# Altium schematic sheet Rectifier.SchDoc: <Document>
size Letter; Engineer: <Engineer>; Organization: UPEL; Address1: USU Power Electronics Lab; Address2: USTAR Building 620, RM 118; Address3: 1600 N 620 E; Address4: North Logan, UT 84341; DocumentNumber: 13; Revision: v1; SheetNumber: 13; SheetTotal: 16; ProjectName: <Project>
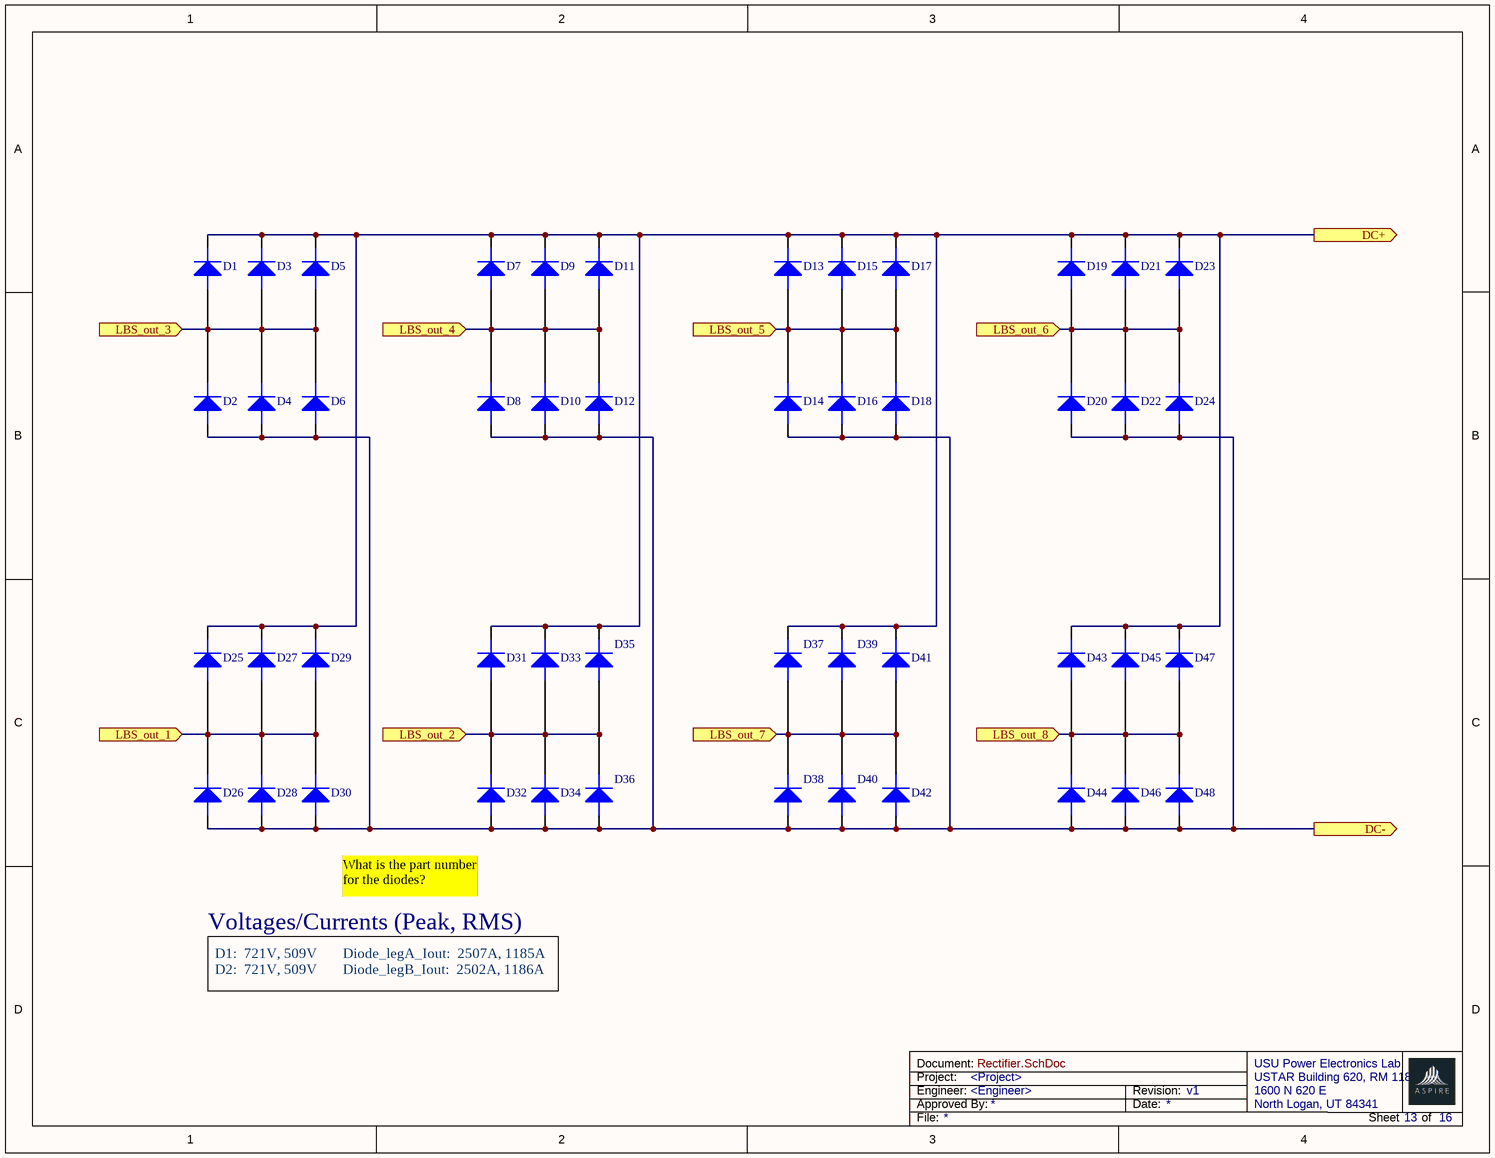
[diagram p0: Rectifier.SchDoc]

## Parts
D1  Diode  (value not drawn)
D2  Diode  (value not drawn)
D3  Diode  (value not drawn)
D4  Diode  (value not drawn)
D5  Diode  (value not drawn)
D6  Diode  (value not drawn)
D7  Diode  (value not drawn)
D8  Diode  (value not drawn)
D9  Diode  (value not drawn)
D10  Diode  (value not drawn)
D11  Diode  (value not drawn)
D12  Diode  (value not drawn)
D13  Diode  (value not drawn)
D14  Diode  (value not drawn)
D15  Diode  (value not drawn)
D16  Diode  (value not drawn)
D17  Diode  (value not drawn)
D18  Diode  (value not drawn)
D19  Diode  (value not drawn)
D20  Diode  (value not drawn)
D21  Diode  (value not drawn)
D22  Diode  (value not drawn)
D23  Diode  (value not drawn)
D24  Diode  (value not drawn)
D25  Diode  (value not drawn)
D26  Diode  (value not drawn)
D27  Diode  (value not drawn)
D28  Diode  (value not drawn)
D29  Diode  (value not drawn)
D30  Diode  (value not drawn)
D31  Diode  (value not drawn)
D32  Diode  (value not drawn)
D33  Diode  (value not drawn)
D34  Diode  (value not drawn)
D35  Diode  (value not drawn)
D36  Diode  (value not drawn)
D37  Diode  (value not drawn)
D38  Diode  (value not drawn)
D39  Diode  (value not drawn)
D40  Diode  (value not drawn)
D41  Diode  (value not drawn)
D42  Diode  (value not drawn)
D43  Diode  (value not drawn)
D44  Diode  (value not drawn)
D45  Diode  (value not drawn)
D46  Diode  (value not drawn)
D47  Diode  (value not drawn)
D48  Diode  (value not drawn)

## Ports
DC+ (out), DC- (out), LBS_out_1 (in), LBS_out_2 (in), LBS_out_3 (in), LBS_out_4 (in), LBS_out_5 (in), LBS_out_6 (in), LBS_out_7 (in), LBS_out_8 (in)

## Nets
DC+: D1.1 D3.1 D5.1 D7.1 D9.1 D11.1 D13.1 D15.1 D17.1 D19.1 D21.1 D23.1 D25.1 D27.1 D29.1 D31.1 D33.1 D35.1 D37.1 D39.1 D41.1 D43.1 D45.1 D47.1 ; port DC+
DC-: D2.0 D4.0 D6.0 D8.0 D10.0 D12.0 D14.0 D16.0 D18.0 D20.0 D22.0 D24.0 D26.0 D28.0 D30.0 D32.0 D34.0 D36.0 D38.0 D40.0 D42.0 D44.0 D46.0 D48.0 ; port DC-
LBS_out_1: D25.0 D26.1 D27.0 D28.1 D29.0 D30.1 ; port LBS_out_1
LBS_out_2: D31.0 D32.1 D33.0 D34.1 D35.0 D36.1 ; port LBS_out_2
LBS_out_3: D1.0 D2.1 D3.0 D4.1 D5.0 D6.1 ; port LBS_out_3
LBS_out_4: D7.0 D8.1 D9.0 D10.1 D11.0 D12.1 ; port LBS_out_4
LBS_out_5: D13.0 D14.1 D15.0 D16.1 D17.0 D18.1 ; port LBS_out_5
LBS_out_6: D19.0 D20.1 D21.0 D22.1 D23.0 D24.1 ; port LBS_out_6
LBS_out_7: D37.0 D38.1 D39.0 D40.1 D41.0 D42.1 ; port LBS_out_7
LBS_out_8: D43.0 D44.1 D45.0 D46.1 D47.0 D48.1 ; port LBS_out_8

## Notes on the sheet
- What is the part number for the diodes?
- Voltages/Currents (Peak, RMS)
- D1:  721V, 509V
  D2:  721V, 509V
- Diode_legA_Iout:  2507A, 1185A
  Diode_legB_Iout:  2502A, 1186A
- Project:
- Engineer:
- Document:
- Approved By:
- Date:
- Revision:
- File:
- Sheet
- of